# EAGLE schematic LEDBOARD_v2 (EAGLE 9.5.2)
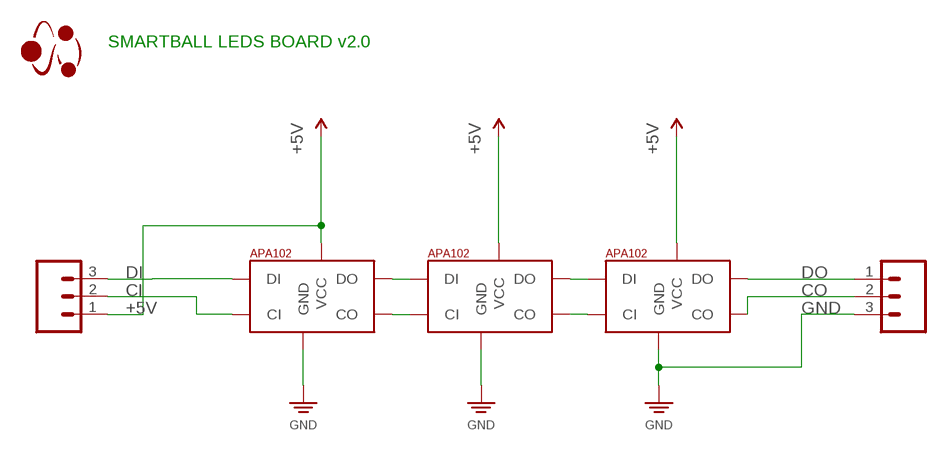
[diagram p0: schematic, sheet 1]

## Parts
L1  APA102  [APA102_5050_SB]
L2  APA102  [APA102_5050_SB]
L3  APA102  [APA102_5050_SB]
U$4  LOGO_SMARTBALL  [SMARTBALL_LOGO]
U$5  CONN_03_SMD_MALECONN03_SMD_MALE  [CONN03_SMD_MALE]
U$6  CONN_03_SMD_MALECONN03_SMD_MALE  [CONN03_SMD_MALE]

## Nets
+5V: L1.4(VCC) L2.4(VCC) L3.4(VCC) U$5.1
CI: L1.2(CI) L1.CI2(CI) U$5.2
CO: L3.5(CO) U$6.2
DI: L1.1(DI) L1.DI2(DI) U$5.3
DO: L3.6(DO) U$6.1
GND: L1.3(GND) L1.GND2(GND) L2.3(GND) L2.GND2(GND) L3.3(GND) L3.GND2(GND) U$6.3
N$7: L1.6(DO) L2.1(DI) L2.DI2(DI)
N$8: L1.5(CO) L2.2(CI) L2.CI2(CI)
N$9: L2.6(DO) L3.1(DI) L3.DI2(DI)
N$10: L2.5(CO) L3.2(CI) L3.CI2(CI)

## Notes on the sheet
- SMARTBALL LEDS BOARD v2.0

## Library data of the parts
L1-L3 = Smartball:APA102: DotStar APA102C 5050
U$4 = Smartball:LOGO_SMARTBALL: Smartball Logo
U$5 U$6 = Smartball:CONN_03_SMD_MALE: CONN_03_MALE

## Net classes
0 default: width 0.152 mm
1 power: width 0.254 mm